# EAGLE design working (EAGLE 9.5.0)
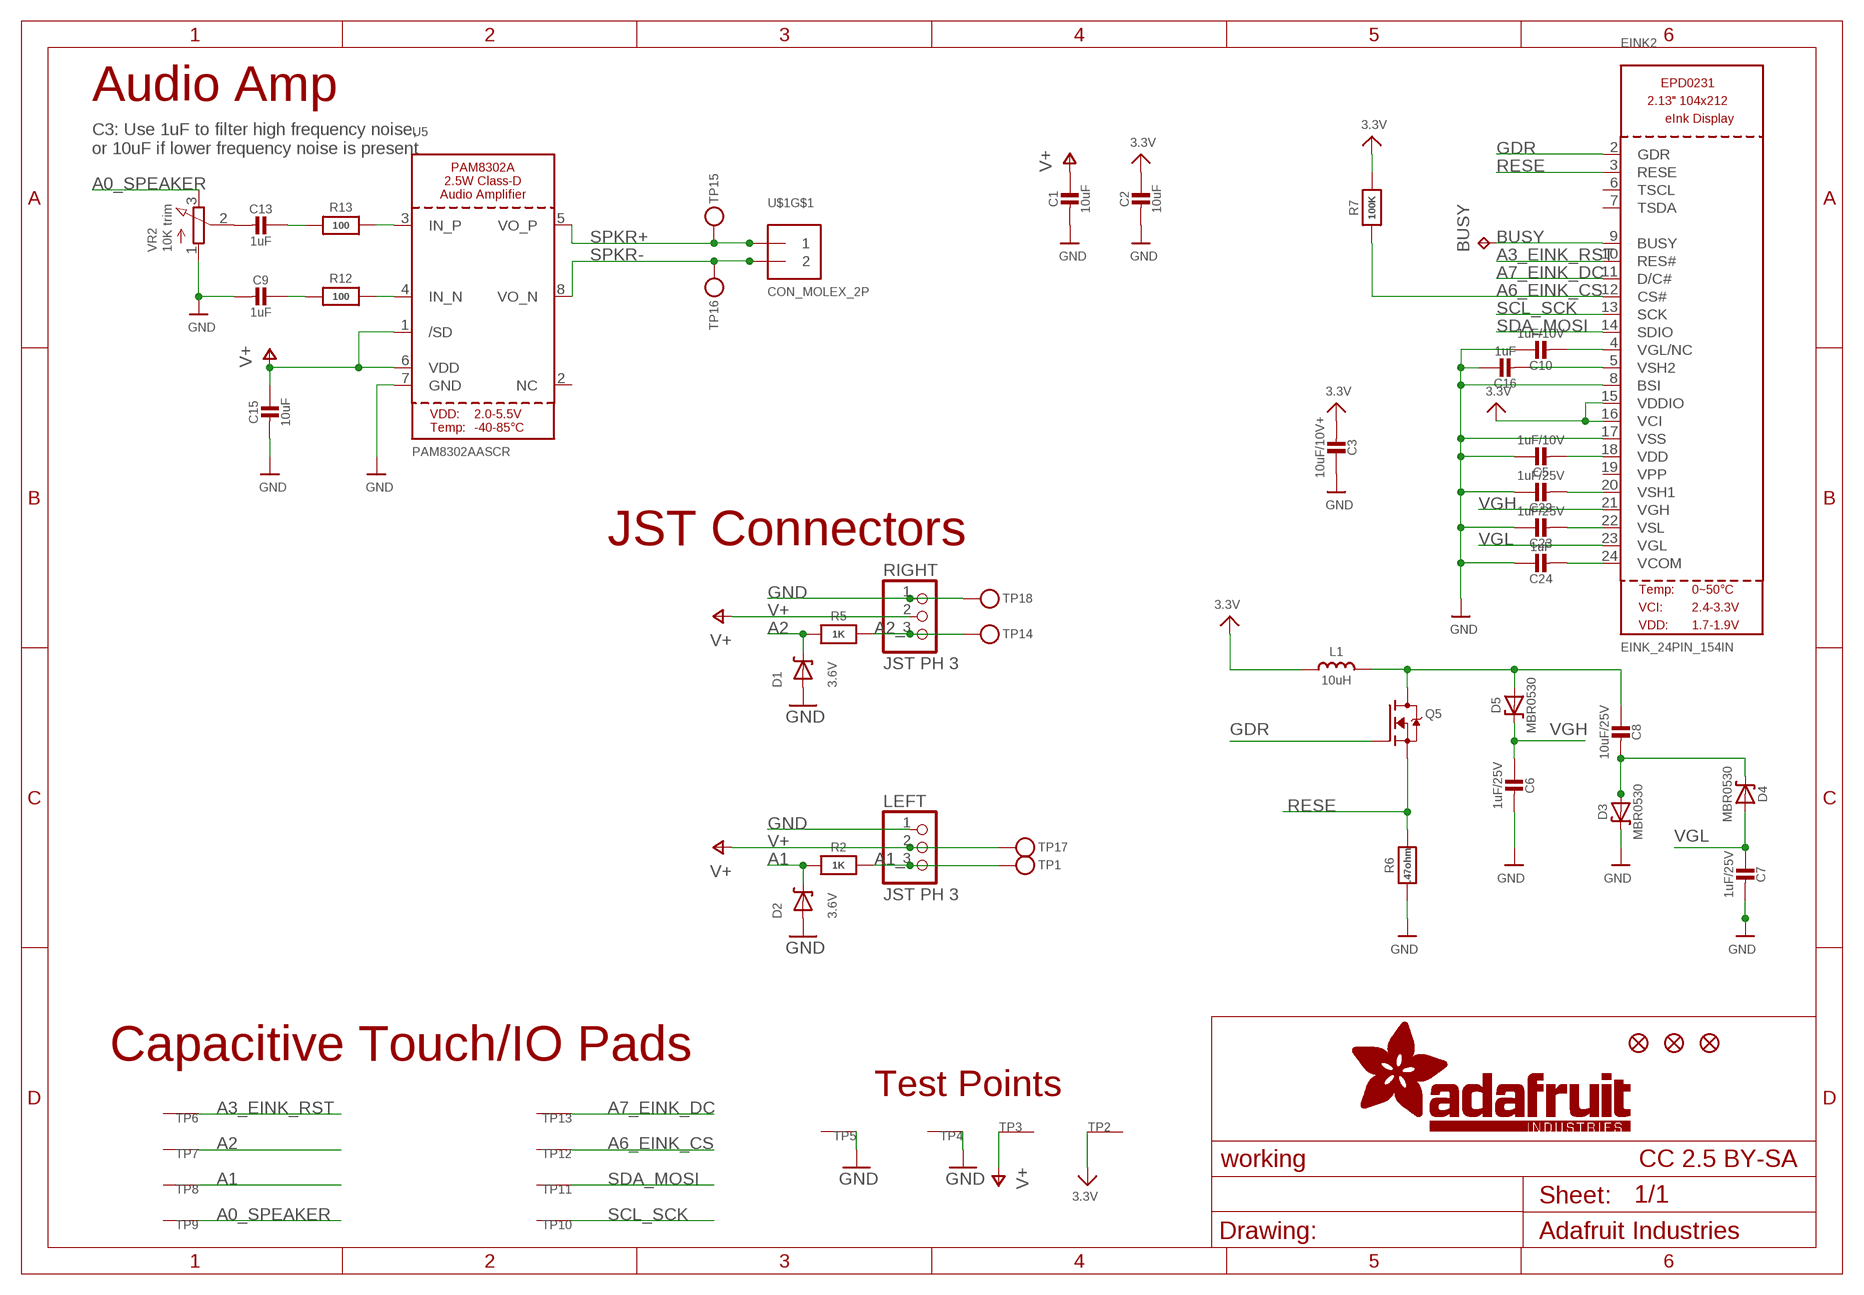
[diagram p0: schematic, sheet 1]

## Parts
BUSY  TPTP15SQ  [TP15SQ]
C1  10uF  CAP_CERAMIC0805-NOOUTLINE  [0805-NO]
C2  10uF  CAP_CERAMIC0805-NOOUTLINE  [0805-NO]
C3  10uF/10V+  CAP_CERAMIC0805-NOOUTLINE  [0805-NO]
C5  1uF/10V  CAP_CERAMIC0805-NOOUTLINE  [0805-NO]
C6  1uF/25V  CAP_CERAMIC0805-NOOUTLINE  [0805-NO]
C7  1uF/25V  CAP_CERAMIC0805-NOOUTLINE  [0805-NO]
C8  10uF/25V  CAP_CERAMIC0805-NOOUTLINE  [0805-NO]
C9  1uF  CAP_CERAMIC0805-NOOUTLINE  [0805-NO]
C10  1uF/10V  CAP_CERAMIC0805-NOOUTLINE  [0805-NO]
C13  1uF  CAP_CERAMIC0805-NOOUTLINE  [0805-NO]
C15  10uF  CAP_CERAMIC0805-NOOUTLINE  [0805-NO]
C16  1uF  CAP_CERAMIC0805-NOOUTLINE  [0805-NO]
C22  1uF/25V  CAP_CERAMIC0805-NOOUTLINE  [0805-NO]
C23  1uF/25V  CAP_CERAMIC0805-NOOUTLINE  [0805-NO]
C24  1uF  CAP_CERAMIC0805-NOOUTLINE  [0805-NO]
D1  3.6V  DIODE-ZENERSOD323  [SOD-323]
D2  3.6V  DIODE-ZENERSOD323  [SOD-323]
D3  MBR0530  DIODE-SCHOTTKYSOD-123  [SOD-123]
D4  MBR0530  DIODE-SCHOTTKYSOD-123  [SOD-123]
D5  MBR0530  DIODE-SCHOTTKYSOD-123  [SOD-123]
EINK2  EINK_24PIN_154IN  [EINK_154IN]
L1  10uH  INDUCTORNR401  [INDUCTOR_4X4MM_NR401]
LEFT  JST PH 3  CON_JST_PH_3PIN  [JSTPH3]
Q5  IRLML0100  IRLML2060TRPBF  [SOT23-3]
R2  1K  RESISTOR_0603_NOOUT  [0603-NO]
R5  1K  RESISTOR_0603_NOOUT  [0603-NO]
R6  .47ohm  RESISTOR0805_10MGAP  [0805_10MGAP]
R7  100K  RESISTOR_0603_NOOUT  [0603-NO]
R12  100  RESISTOR_0603_NOOUT  [0603-NO]
R13  100  RESISTOR_0603_NOOUT  [0603-NO]
RIGHT  JST PH 3  CON_JST_PH_3PIN  [JSTPH3]
TP1  TESTPOINTROUND1.5MMNO  [TESTPOINT_ROUND_1.5MM_NO]
TP2  SEWTAP_SMTNUTM3  [SMT_NUT_3MM]
TP3  SEWTAP_SMTNUTM3  [SMT_NUT_3MM]
TP4  SEWTAP_SMTNUTM3  [SMT_NUT_3MM]
TP5  SEWTAP_SMTNUTM3  [SMT_NUT_3MM]
TP6  SEWTAP_SMTNUTM3  [SMT_NUT_3MM]
TP7  SEWTAP_SMTNUTM3  [SMT_NUT_3MM]
TP8  SEWTAP_SMTNUTM3  [SMT_NUT_3MM]
TP9  SEWTAP_SMTNUTM3  [SMT_NUT_3MM]
TP10  SEWTAP_SMTNUTM3  [SMT_NUT_3MM]
TP11  SEWTAP_SMTNUTM3  [SMT_NUT_3MM]
TP12  SEWTAP_SMTNUTM3  [SMT_NUT_3MM]
TP13  SEWTAP_SMTNUTM3  [SMT_NUT_3MM]
TP14  TESTPOINTROUND1.5MMNO  [TESTPOINT_ROUND_1.5MM_NO]
TP15  TESTPOINTROUND1.5MMNO  [TESTPOINT_ROUND_1.5MM_NO]
TP16  TESTPOINTROUND1.5MMNO  [TESTPOINT_ROUND_1.5MM_NO]
TP17  TESTPOINTROUND1.5MMNO  [TESTPOINT_ROUND_1.5MM_NO]
TP18  TESTPOINTROUND1.5MMNO  [TESTPOINT_ROUND_1.5MM_NO]
U5  PAM8302AASCR  AUDIOAMP_PAM8302A  [MSOP8_0.65MM]
U$1  CON_MOLEX_2P  [53398-0271]
U$2  FIDUCIAL_1MM  [FIDUCIAL_1MM]
U$3  FIDUCIAL_1MM  [FIDUCIAL_1MM]
U$6  FIDUCIAL_1MM  [FIDUCIAL_1MM]
VR2  10K trim  TRIMPOT3303W/X  [TRIMPOT_BOURNS_3303W]

## Nets
3.3V: C2.1 C3.2 EINK2.15(VDDIO) EINK2.16(VCI) L1.P$2 R7.2 TP2.P$1(SEW)
A0_SPEAKER: TP9.P$1(SEW) VR2.3(E)
A1: D2.C R2.2 TP8.P$1(SEW)
A1_: LEFT.3 R2.1 TP1.P$1
A2: D1.C R5.2 TP7.P$1(SEW)
A2_: R5.1 RIGHT.3 TP14.P$1
A3_EINK_RST: EINK2.10(RES#) TP6.P$1(SEW)
A6_EINK_CS: EINK2.12(CS#) R7.1 TP12.P$1(SEW)
A7_EINK_DC: EINK2.11(D/C#) TP13.P$1(SEW)
BUSY: BUSY.TP EINK2.9(BUSY)
GDR: EINK2.2(GDR) Q5.1(G)
GND: C1.2 C2.2 C3.1 C5.1 C6.2 C7.2 C9.2 C10.1 C15.2 C16.1 C22.1 C23.1 C24.1 D1.A D2.A D3.C EINK2.8(BSI) EINK2.17(VSS) LEFT.1 R6.2 RIGHT.1 TP4.P$1(SEW) TP5.P$1(SEW) TP18.P$1 U5.7(GND) VR2.1(A)
N$2: C8.2 D3.A D4.C
N$3: C8.1 D5.A L1.P$1 Q5.3(D)
N$4: C16.2 EINK2.5(VSH2)
N$5: C5.2 EINK2.18(VDD)
N$6: C22.2 EINK2.20(VSH1)
N$9: C10.2 EINK2.4(VGL/NC)
N$19: R12.2 U5.4(IN_N)
N$20: R13.2 U5.3(IN_P)
N$21: C9.1 R12.1
N$22: C13.1 R13.1
N$23: C13.2 VR2.2(S)
N$27: C23.2 EINK2.22(VSL)
N$33: C24.2 EINK2.24(VCOM)
RESE: EINK2.3(RESE) Q5.2(S) R6.1
SCL_SCK: EINK2.13(SCK) TP10.P$1(SEW)
SDA_MOSI: EINK2.14(SDIO) TP11.P$1(SEW)
SPKR+: TP15.P$1 U5.5(VO_P) U$1.1
SPKR-: TP16.P$1 U5.8(VO_N) U$1.2
V+ [thickpower]: C1.1 C15.1 LEFT.2 RIGHT.2 TP3.P$1(SEW) TP17.P$1 U5.1(/SD) U5.6(VDD)
VGH: C6.1 D5.C EINK2.21(VGH)
VGL: C7.1 D4.A EINK2.23(VGL)
Unconnected: EINK2.6(TSCL) EINK2.7(TSDA) EINK2.19(VPP) U5.2(NC) U$1.M1(MT) U$1.M2(MT)

## Notes on the sheet
- Audio Amp
- C3: Use 1uF to filter high frequency noise,
  or 10uF if lower frequency noise is present
- JST Connectors
- Capacitive Touch/IO Pads
- Test Points
- CC 2.5 BY-SA

## Library data of the parts
BUSY = testpad:TP: Test pad
C1-C3 C5-C10 C13 C15 C16 C22-C24 = microbuilder:CAP_CERAMIC: Ceramic Capacitors For new designs, use the packages preceded by an '_' character since they are more reliable: The following footprints should be used on most boards: _0402 - Standard footprint for regular board layouts _0603 - Standard footprint for regular board layouts _0805 - Standard footprint for regular board layouts _1206 - Standard footprint for regular board layouts For extremely tight-pitch boards where space is at a premium, the following 'micro-pitch' footprints can be used (smaller pads, no silkscreen outline, etc.): _0402MP - Micro-pitch footprint for very dense/compact boards _0603MP - Micro-pitch footprint for very dense/compact boards _0805MP - Micro-pitch footprint for very dense/compact boards _1206MP - Micro-pitch footprint for very dense/compact boards
D1 D2 = microbuilder:DIODE-ZENER: Zener Diode SMA: 30V 1W Zener Diode, 1.2Vf - Digikey: SMAZ30-FDICT-ND
D3-D5 = microbuilder:DIODE-SCHOTTKY
EINK2 = adafruit_display:EINK_24PIN
L1 = microbuilder:INDUCTOR: Inductors 0603: 10nH Ceramic Inductor - microwire antenna/RF (Digikey: 712-1434-2-ND) 0805: 560nH Ceramic Inductor - RF (Digikey: 553-1047-1-ND) 270nH Ceramic Inductor - Q = 40@250MHz, +-5%, 1 Ohm DC Resistance (Digikey: 535-10506-2-ND) 1007 (2518 Metric) SMT: 10µH 10% 250mOhm 820mA 1007 Inductor (Digikey: 587-2189-1-ND) 22µH 10% 500mOhm 580mA 1007 Inductor (Digikey: 587-2190-1-ND) 47µH 10% 950mOhm 420mA 1007 Inductor (Digikey: 587-2191-1-ND) 47µH 5% 100mOhm 1A 1008 Inductor (Digikey: 732-1816-1-ND) 5.0x5.0mm (Taiyo Yuden NR5040 Series) 6.8µH 20% 2.3A 64mOhm Inductor (Digikey: 587-2374-2-ND) 5.0x5.0mm (TDK VLC5045 Series) 4.7µH 20% 3.3A 34mOhm Inductor (Digikey: 445-6526-1-ND) 6.8µH 20% 2.7A 46mOhm Inductor (Digikey: 445-6527-1-ND) 6.0x6.0mm (TDK VLC6045 Series) 4.7µH 20% 3.8A 27mOhm Inductor (Digikey: 445-6538-2-ND) 6.8µH 20% 3A 41mOhm Inductor (Digikey: 445-6540-1-ND) 6.2µH 30% 2.2A 45mOhm Inductor (Digikey: SRR5028-6R2YCT-ND) - Not TDK VLC6045 but footprint should match 6.0x6.0mm (TDK SLF6045 Series) 6.8uH 30% 2A 33mOhm Inductor (Digikey: 445-4572-1-ND, Mouser: 810-SLF645T6R8N2R0PF) 6.0x6.0mm (Sumida CDRH5D28 Series) 6.2uH 30% 1.8A 45mOhm Inductor (Digikey: 308-1542-1-ND) Taiyo Yuden NR3015T2R2M - 2.2uH 20% 1.5A (Digikey: 587-1648-2-ND, Mouser: 963-NR3015T2R2M) - Used with TI TPS62172 CoilCraft RFID Transponder Coil - MA5532-AE (For use with AS3935 Lightning Sensor) Taiyo Yuden NRH2412T2R2MNGH - 2.2uH 20% 1AA (Digikey: 587-3443-1-ND) - Used with TI LM3671 Vishay IHLP 1.0uH Molded Inductor - 24mOhm DCR, 5A, +/-20%, -55°C-125°C (Digikey: 541-1319-1-ND)
LEFT RIGHT = microbuilder:CON_JST_PH_3PIN
Q5 = Parts:IRLML2060TRPBF
R2 R5-R7 R12 R13 = microbuilder:RESISTOR: Resistors For new designs, use the packages preceded by an '_' character since they are more reliable: The following footprints should be used on most boards: _0402 - Standard footprint for regular board layouts _0603 - Standard footprint for regular board layouts _0805 - Standard footprint for regular board layouts _1206 - Standard footprint for regular board layouts For extremely tight-pitch boards where space is at a premium, the following 'micro-pitch' footprints can be used (smaller pads, no silkscreen outline, etc.): _0402MP - Micro-pitch footprint for very dense/compact boards _0603MP - Micro-pitch footprint for very dense/compact boards _0805MP - Micro-pitch footprint for very dense/compact boards _1206MP - Micro-pitch footprint for very dense/compact boards
TP1 TP14-TP18 = microbuilder:TESTPOINT: Test Point Various test points for characterisation and PCB testing TESTPOINT_SMT - Compact Surface Mount Test Point [Digikey: 5016KTR-ND]
TP2-TP13 = microbuilder:SEWTAP
U5 = microbuilder:AUDIOAMP_PAM8302A: PAM8302A - 2.5W Class-D Mono Audio Amplifier MSOP8 = PAM8302AASCR
U$1 = microbuilder:CON_MOLEX_2P
U$2 U$3 U$6 = microbuilder:FIDUCIAL: Fiducial Alignment Points Various fiducial points for machine vision alignment.; BOM: EXCLUDE
VR2 = microbuilder:TRIMPOT: 3-Pin SMT Trimpots Bourns TC33 (X-2) Series 1K - Digikey: TC33X-102ECT-ND 10K - Digikey: TC33X-2-103E 100K - Digikey: TC33X-104ECT-ND Bourns 3303 (W) Series 3mm 10K Single Turn - Digikey: 3303W-103ETR-ND 3mm 100K Single Turn - Digikey: 3303X-104ETR-ND

## Net classes
1 power: width 0.254 mm
2 thickpower: width 0.406 mm

## Board
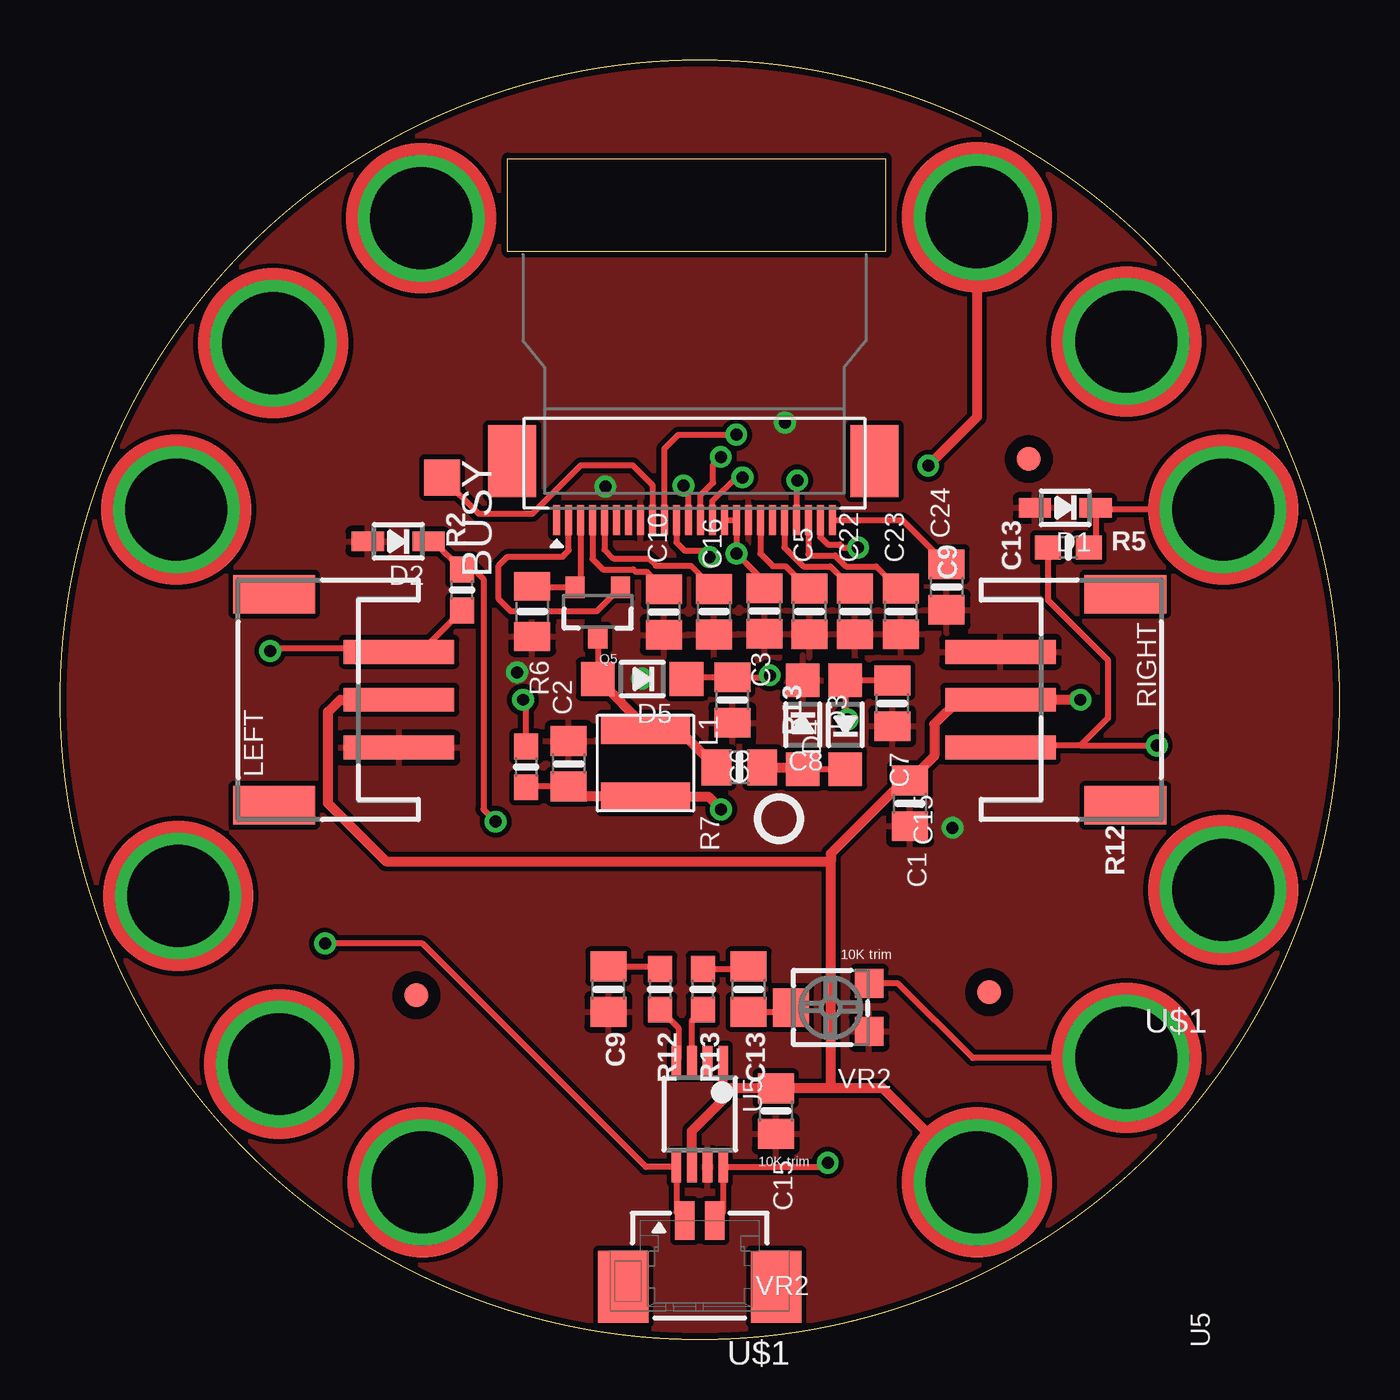
[diagram p1: board, top side]
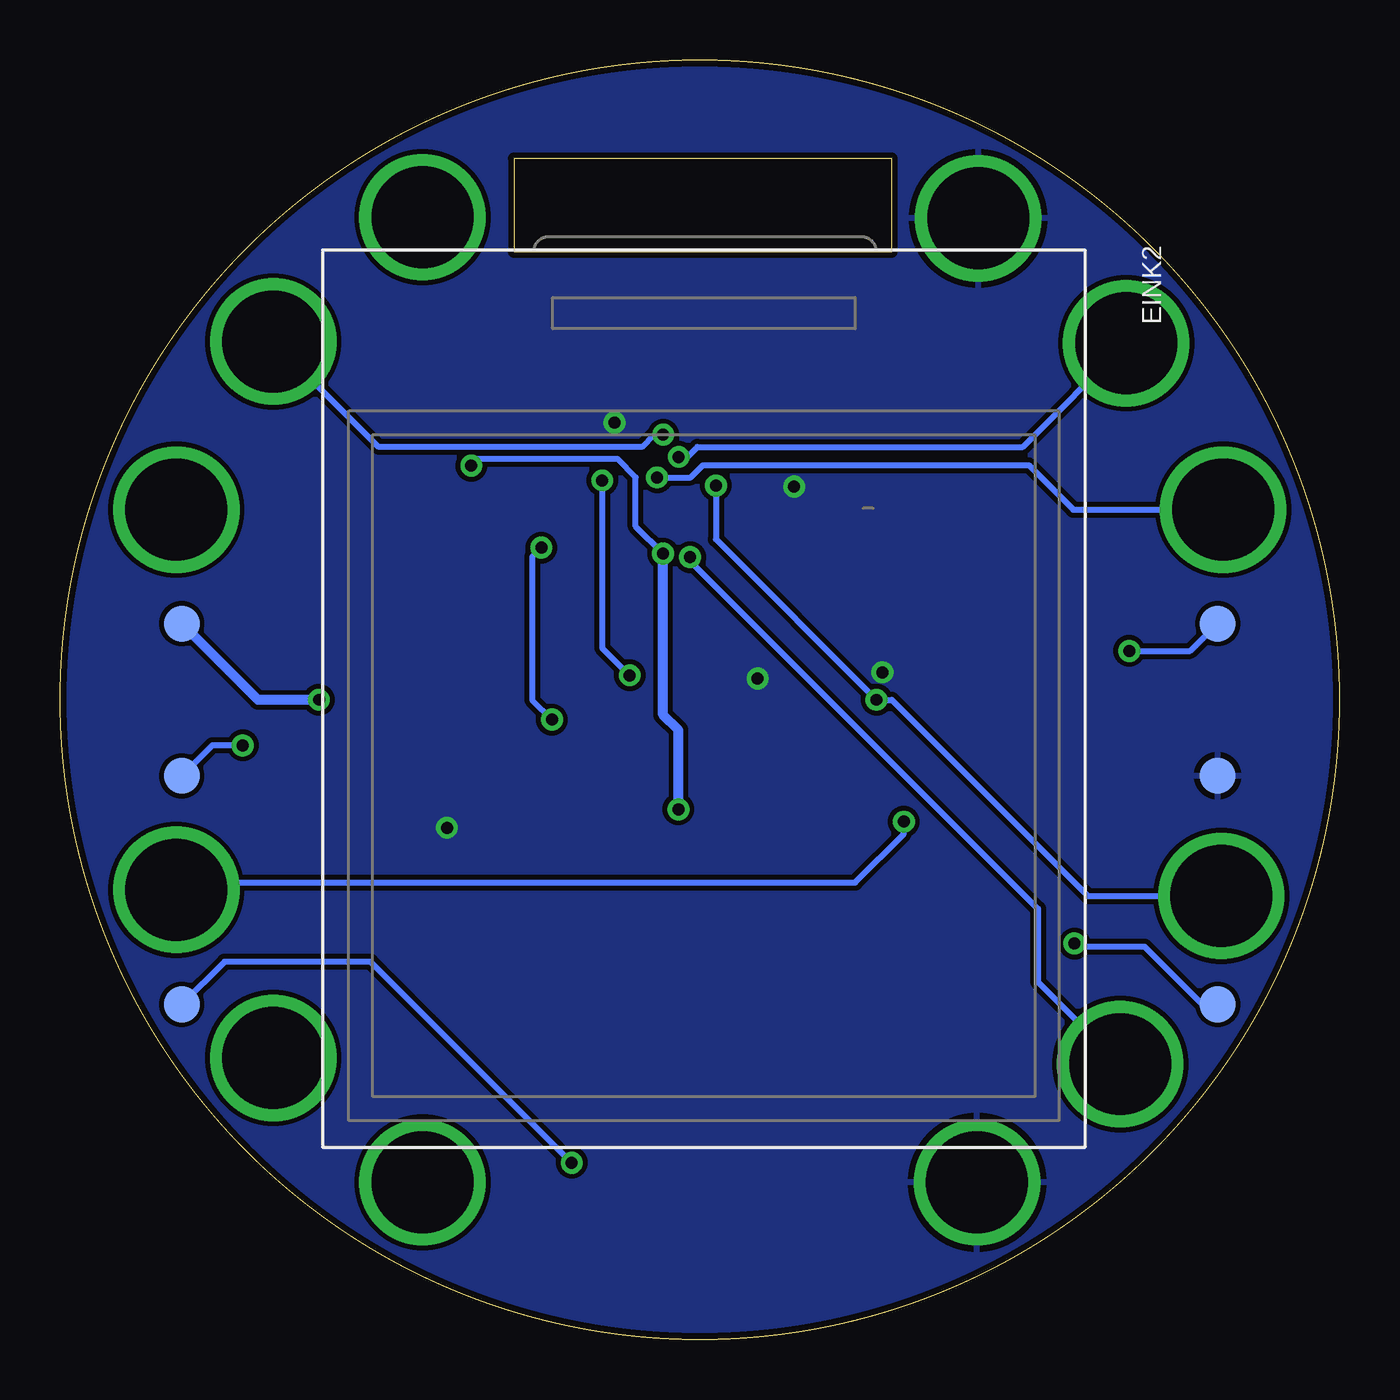
[diagram p2: board, bottom side, seen from below]

Size 53.34 x 53.34 mm. Coordinates in mm from the lower left corner, seen from the top.
Outline: 34.42,45.34 18.67,45.34 18.67,49.23 34.42,49.23 34.42,45.34
Outline: circle at 26.67,26.67 radius 26.67
Copper layers (1*16): Top 0.035mm / dielectric 1.5mm / Bottom 0.035mm
Design rules "adafruit *": minimum track width 8mil, minimum drill 15.5mil, track to track 8mil, track to pad 7mil, pad to pad 8mil, via to via 8mil, smd to smd 8mil, copper to edge 10mil, drill to drill 8mil, minimum pad ring 10mil, minimum via ring 8mil, stop-mask expansion 2mil, vias tented up to drill 20mil, thermal gap 10mil

### Footprints (pad centres in the part's own frame; a part is rotated, then mirrored left to right if it is on the bottom)
TP15SQ = smd 1.5 x 1.5: TP 0,0
0805-NO = smd 1.24 x 1.5: 1 -0.95,0; 2 0.95,0
SOD-323 = smd 1.35 x 0.8: A 1.27,0; C -1.27,0
SOD-123 = smd 1.4 x 1.4: A 1.85,0; C -1.85,0
EINK_154IN = smd 1.25 x 0.275 bottom: 1 3.56,-8; 2 3.56,-8.5; 3 3.56,-9; 4 3.56,-9.5; 5 3.56,-10; 6 3.56,-10.5; 7 3.56,-11; 8 3.56,-11.5; 9 3.56,-12; 10 3.56,-12.5; 11 3.56,-13; 12 3.56,-13.5; 13 3.56,-14; 14 3.56,-14.5; 15 3.56,-15; 16 3.56,-15.5; 17 3.56,-16; 18 3.56,-16.5; 19 3.56,-17; 20 3.56,-17.5; 21 3.56,-18; 22 3.56,-18.5; 23 3.56,-19; 24 3.56,-19.5 | smd 3 x 2 bottom: SPRT1 1.1,-6.15; SPRT2 1.1,-21.26
INDUCTOR_4X4MM_NR401 = smd 1.2 x 3.7: P$1 -1.4,0; P$2 1.4,0
JSTPH3 = smd 1 x 4.6: 1 -2,-2.7; 2 0,-2.7; 3 2,-2.7 | smd 1.6 x 3.4: NC1 -4.4,2.5; NC2 4.4,2.5
SOT23-3 = smd 0.8 x 0.9: 1 -0.95,-1; 2 0.95,-1; 3 0,1.1
0603-NO = smd 1.075 x 1: 1 -0.85,0; 2 0.85,0
0805_10MGAP = smd 1.2 x 1.5: 1 -1.05,0; 2 1.05,0
TESTPOINT_ROUND_1.5MM_NO = smd 1.5 x 1.5: P$1 0,0
SMT_NUT_3MM = drill 4.25 pad 4.572: P$1 0,0
MSOP8_0.65MM = smd 0.4 x 1.3: 1 -0.975,-2.2; 2 -0.325,-2.2; 3 0.325,-2.2; 4 0.975,-2.2; 5 0.975,2.2; 6 0.325,2.2; 7 -0.325,2.2; 8 -0.975,2.2
53398-0271 = smd 0.8 x 1.6: 1 0.625,-1.27; 2 -0.625,-1.27 | smd 2.1 x 3: M1 3.185,1.48; M2 -3.185,1.48
FIDUCIAL_1MM = smd 1 x 1: 1 0,0
TRIMPOT_BOURNS_3303W = smd 1.2 x 1.2: 1 -1,-1.6; 3 1,-1.6 | smd 1.6 x 1.5: 2 0,1.65

### Placement (x,y rotation side)
BUSY  15.94,35.94 270 top
C1  35.43,22.35 270 top
C2  21.21,24 90 top
C3  29.36,30.37 90 top
C5  31.24,30.35 90 top
C6  28.03,26.66 270 top
C7  34.7,26.52 270 top
C8  28.32,23.85 0 top
C9  22.86,14.61 270 top
C10  25.17,30.33 90 top
C13  28.7,14.61 270 top
C15  29.85,9.53 270 top
C16  27.26,30.34 90 top
C22  33.15,30.35 90 top
C23  35.05,30.35 90 top
C24  36.96,31.37 90 top
D1  41.91,34.67 180 top
D2  14.1,33.27 180 top
D3  30.96,25.63 270 top
D4  32.74,25.63 90 top
D5  24.27,27.53 180 top
EINK2  12.7,37.72 270 bottom
L1  24.41,24.03 270 top
LEFT  11.43,26.67 90 top
Q5  22.42,30.35 180 top
R2  16.76,31.24 90 top
R5  42.04,33.02 0 top
R6  19.69,30.35 270 top
R7  19.43,23.88 270 top
R12  25.02,14.61 270 top
R13  26.8,14.61 270 top
RIGHT  41.91,26.67 270 top
TP1  5.08,29.85 0 bottom
TP2  38.23,46.79 90 top
TP3  38.23,6.55 90 top
TP4  15.06,46.74 90 top
TP5  15.11,6.55 90 top
TP6  44.45,41.61 90 top
TP7  48.49,34.59 90 top
TP8  48.49,18.75 90 top
TP9  44.45,11.73 90 top
TP10  8.89,41.53 90 top
TP11  4.85,34.59 90 top
TP12  4.93,18.49 90 top
TP13  9.14,11.48 90 top
TP14  48.26,23.5 0 bottom
TP15  5.08,13.97 0 bottom
TP16  48.26,13.97 0 bottom
TP17  48.26,29.85 0 bottom
TP18  5.08,23.5 0 bottom
U5  26.67,9.4 180 top
U$1  26.67,3.68 180 top
U$2  40.39,36.7 0 top
U$3  14.86,14.35 0 top
U$4  [EINKGIZMO_BACK]  0,0 0 top
U$6  38.73,14.48 0 top
U$7  [PCBFEAT-REV-040]  29.97,21.72 0 top
U$8  [EINKGIZMO_FRONT]  53.34,0 0 bottom
VR2  32.13,13.84 90 top

### Tracks (layer width: path | path; a pad name or v marks a point on that pad's centre or on a via)
3.3V  (via drill 0.5)
  Top 0.254: EINK2.15 EINK2.16 v28.2,32.76 29.36,31.6 C3.2 | C2.1 19.46,23.05 R7.2
  Top 0.406: v27.56,22.1 27.03,22.63 L1.P$2 21.63,22.63 C2.1 | TP2.P$1 38.23,38.46 v36.2,36.43
  Bottom 0.254: v28.2,32.76 29.34,33.9 29.34,35.94 30.1,36.7 35.92,36.7 v36.2,36.43
  Bottom 0.406: v27.56,22.1 27.56,25.4 28.2,26.04 v28.2,32.76
A0_SPEAKER
  Top 0.254: VR2.3 34.94,14.84 38.05,11.74 TP9.P$1
A1  (via drill 0.5 pad 0.55)
  Top 0.254: D2.C 15.58,33.27 R2.2 17.27,32.09 17.65,31.71 17.65,22.1 v18.16,21.59
  Bottom 0.254: TP8.P$1 48.18,19.05 20.19,19.05 18.16,21.08 v18.16,21.59
A1_  (via drill 0.5)
  Top 0.254: v8.76,28.7 8.86,28.8 13.46,28.8 15.17,28.8 R2.1
  Top 0.406: LEFT.3 14,28.8 13.46,28.8
  Bottom 0.254: v8.76,28.7 6.22,28.7 TP1.P$1
A2
  Top 0.254: TP7.P$1 43.26,34.59 D1.C 43.18,33.31 R5.2
A2_  (via drill 0.5)
  Top 0.254: R5.1 41.19,30.82 43.69,28.32 43.69,25.91 42.55,24.77 | 42.55,24.77 38.61,24.77 38.7,24.67 RIGHT.3 | 42.55,24.77 v45.72,24.77
  Bottom 0.254: v45.72,24.77 46.99,24.77 TP14.P$1
A3_EINK_RST  (via drill 0.5)
  Top 0.254: EINK2.10 25.2,37.14 25.78,37.72 v28.19,37.72
  Bottom 0.254: v28.19,37.72 28.58,37.72 29.08,37.21 40.06,37.21 TP6.P$1
A6_EINK_CS  (via drill 0.5)
  Top 0.254: EINK2.12 26.2,35.4 v25.99,35.6 | R7.1 19.43,26.67 v19.3,26.67
  Bottom 0.254: v25.99,35.6 25.99,33.36 v19.3,26.67 18.67,26.67 10.49,18.49 TP12.P$1
A7_EINK_DC  (via drill 0.5)
  Top 0.254: EINK2.11 25.7,33.23 26.06,32.87 26.82,32.87 v27.08,32.62
  Bottom 0.254: v27.08,32.62 27.08,32.46 12.57,17.96 12.57,14.91 TP13.P$1
BUSY
  Top 0.254: BUSY.TP 17.46,34.42 19.69,34.42 21.72,36.45 23.88,36.45 24.7,35.62 EINK2.9
GDR
  Top 0.254: Q5.1 22.37,30.35 18.8,30.35 18.29,30.86 18.29,32.26 18.67,32.64 20.96,32.64 21.21,32.89 EINK2.2
GND  (via drill 0.5 pad 0.55)
  other vias: 30.23,38.23 22.73,35.56 19.05,27.81 24.26,27.56 37.21,21.34
  pour Top: 0,53.34 53.34,53.34 53.34,0 0,0
  pour Bottom: 0,53.34 53.34,53.34 53.34,0 0,0
N$2
  Top 0.254: D3.A D4.C
  Top 0.406: C8.2 30.89,23.85 D3.A
N$3
  Top 0.254: Q5.3 D5.A
  Top 0.406: D5.A 24.41,25.54 L1.P$1 25.79,25.43 C8.1
N$4
  Top 0.254: EINK2.5 22.7,32.93 23.06,32.56 24.53,32.56 24.84,32.26 26.3,32.26 C16.2
N$5
  Top 0.254: EINK2.18 29.2,32.76 29.72,32.24 30.24,32.24 31.17,31.3 C5.2
N$6
  Top 0.254: EINK2.20 30.2,33.02 30.99,32.23 32.12,32.23 33.04,31.3 C22.2
N$9
  Top 0.254: EINK2.4 22.2,32.54 22.63,32.11 23.89,32.11 24,32 24.45,32 C10.2
N$19
  Top 0.254: R12.2 25.78,12.99 25.78,11.68 U5.4
N$20
  Top 0.254: U5.3 26.35,13.3 R13.2
N$21
  Top 0.254: C9.1 24.92,15.56 R12.1
N$22
  Top 0.254: R13.1 28.6,15.46 C13.1
N$23
  Top 0.254: C13.2 30.29,13.66 VR2.2
N$27
  Top 0.254: EINK2.22 31.2,32.73 31.24,32.69 32.31,32.69 32.77,32.23 34.02,32.23 34.95,31.3 C23.2
N$33
  Top 0.254: EINK2.24 35.12,34.16 C24.2
RESE
  Top 0.254: EINK2.3 21.7,31.59 Q5.2 19.74,31.35 R6.1
SCL_SCK  (via drill 0.5)
  Top 0.254: v27.55,36.79 27.22,36.47 27.22,35.72 26.7,35.2 EINK2.13
  Bottom 0.254: v27.55,36.79 27.18,36.79 26.76,37.21 13.21,37.21 TP10.P$1
SDA_MOSI  (via drill 0.5)
  Top 0.254: EINK2.14 27.2,34.95 28.19,35.94 v28.45,35.94
  Bottom 0.254: v28.45,35.94 27.05,35.94 26.54,36.45 12.95,36.45 11.1,34.59 TP11.P$1
SPKR+  (via drill 0.5)
  Top 0.254: U$1.1 25.7,5.3 U5.5 24.43,7.2 15.11,16.51 v11.05,16.51
  Bottom 0.254: v11.05,16.51 10.92,16.38 8.13,16.38 5.72,13.97 TP15.P$1
SPKR-  (via drill 0.5)
  Top 0.254: U$1.2 27.65,5.3 U5.8 31.84,7.2 v32,7.37
  Bottom 0.254: v32,7.37 40.39,15.75 46.48,15.75 TP16.P$1
V+  (via drill 0.5)
  Top 0.406: U5.6 26.35,8.69 27.65,9.99 27.65,10.54 | 27.65,10.54 U5.1 | 27.65,10.54 27.71,10.48 C15.1 32.13,10.48 | v42.55,26.67 42.35,26.86 42.16,26.67 RIGHT.2 37.47,26.67 36.45,25.65 36.45,24.32 C1.1 35.18,23.3 32.13,20.25 32.13,19.94 | TP3.P$1 34.3,10.48 32.13,10.48 | 32.13,19.94 13.59,19.94 11.18,22.35 11.18,26.16 11.68,26.67 LEFT.2 | 32.13,10.48 32.13,19.94
  Bottom 0.406: v42.55,26.67 45.09,26.67 TP17.P$1
VGH  (via drill 0.5)
  Top 0.254: D5.C 26.19,27.61 C6.1 29.51,27.61 v29.59,27.69 | v30.73,35.81 30.7,35.78 EINK2.21
  Bottom 0.254: v29.59,27.69 30.73,28.83 v30.73,35.81
VGL  (via drill 0.5)
  Top 0.254: EINK2.23 31.7,33.45 32,33.14 32.5,33.14 32.63,33.01 v33.27,33.01 | C7.1 32.75,27.47 D4.A 32.74,25.93 v32.83,25.84
  Bottom 0.254: v32.83,25.84 33.66,26.67 33.66,32.63 v33.27,33.01